# EAGLE design 32sog(a) (EAGLE 7.2.0)
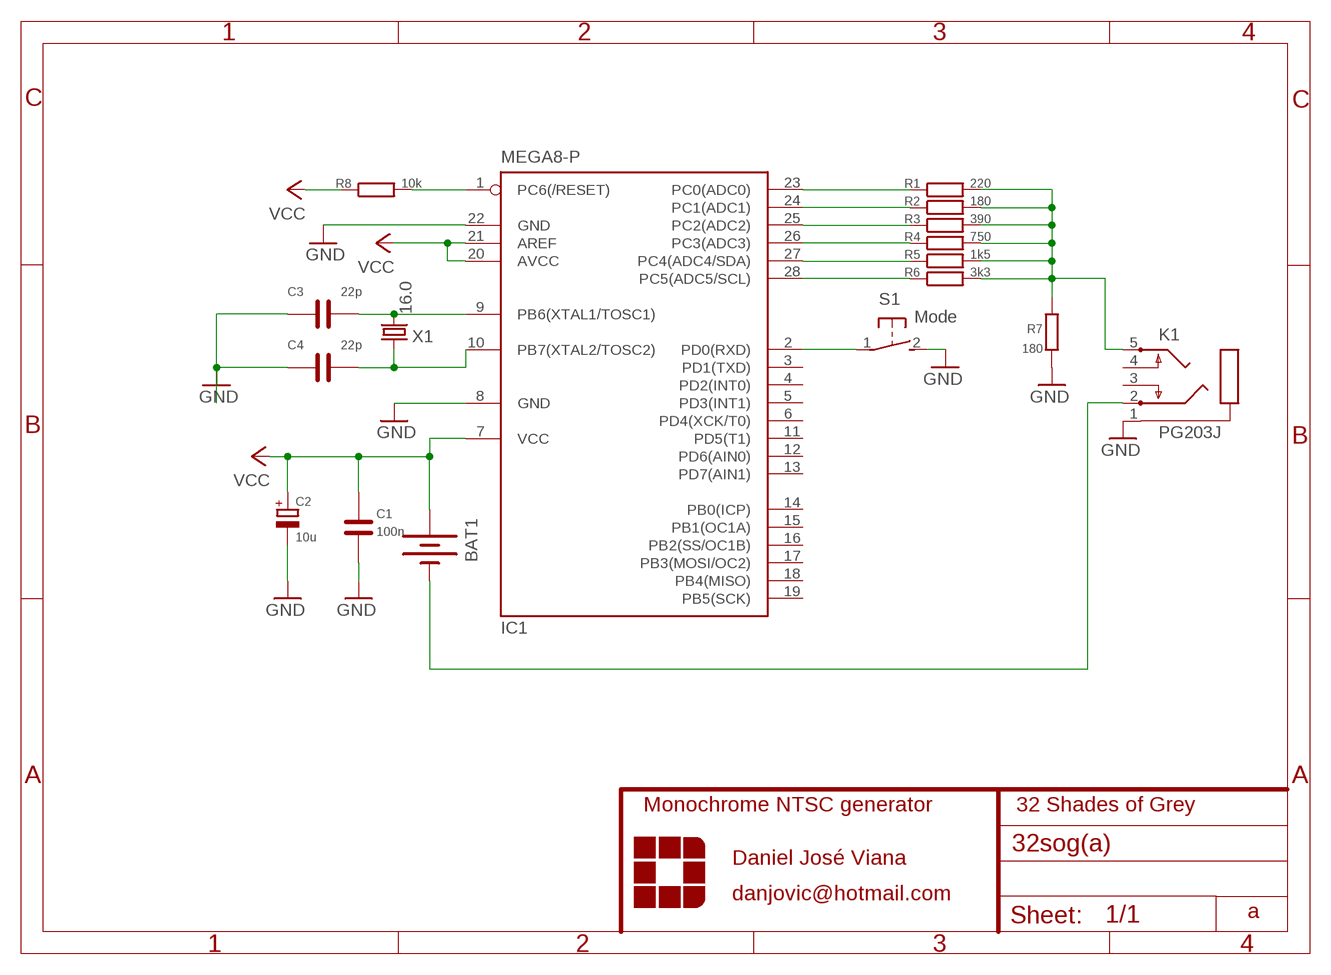
[diagram p0: schematic, sheet 1]

## Parts
BAT1  BATTERY20PTH  [BATTCOM_20MM_PTH]
C1  100n  CCERAMICO  [C050-024X044]
C2  10u  CPOL-EUE2-4_LARGEPADS  [E2-4_LARGEPADS]
C3  22p  CCERAMICO  [C050-024X044]
C4  22p  CCERAMICO  [C050-024X044]
IC1  MEGA8-P  [DIL28-3]
K1  PG203J  [PG203J]
R1  220  R-EU_0207/7  [0207/7]
R2  180  R-EU_0207/7  [0207/7]
R3  390  R-EU_0207/7  [0207/7]
R4  750  R-EU_0207/7  [0207/7]
R5  1k5  R-EU_0207/7  [0207/7]
R6  3k3  R-EU_0207/7  [0207/7]
R7  180  R-EU_0207/7  [0207/7]
R8  10k  R-EU_0207/7  [0207/7]
S1  Mode  31-XX  [B3F-31XX]
X1  16.0  CRYSTALHC49S  [HC49/S]

## Nets
GND: C1.1 C2.- C3.1 C4.1 IC1.8(GND) IC1.22(GND) K1.1 R7.2 S1.2(S)
N$1: IC1.23(PC0(ADC0)) R1.1
N$2: IC1.25(PC2(ADC2)) R3.1
N$3: IC1.1(PC6(/RESET)) R8.2
N$4: IC1.27(PC4(ADC4/SDA)) R5.1
N$5: IC1.24(PC1(ADC1)) R2.1
N$6: IC1.26(PC3(ADC3)) R4.1
N$7: IC1.28(PC5(ADC5/SCL)) R6.1
N$8: C3.2 IC1.9(PB6(XTAL1/TOSC1)) X1.2
N$9: BAT1.2(-) K1.2
N$10: K1.5 R1.2 R2.2 R3.2 R4.2 R5.2 R6.2 R7.1
N$11: C4.2 IC1.10(PB7(XTAL2/TOSC2)) X1.1
N$12: IC1.2(PD0(RXD)) S1.1(P)
VCC: BAT1.1(+) C1.2 C2.+ IC1.7(VCC) IC1.20(AVCC) IC1.21(AREF) R8.1
Unconnected: IC1.3(PD1(TXD)) IC1.4(PD2(INT0)) IC1.5(PD3(INT1)) IC1.6(PD4(XCK/T0)) IC1.11(PD5(T1)) IC1.12(PD6(AIN0)) IC1.13(PD7(AIN1)) IC1.14(PB0(ICP)) IC1.15(PB1(OC1A)) IC1.16(PB2(SS/OC1B)) IC1.17(PB3(MOSI/OC2)) IC1.18(PB4(MISO)) IC1.19(PB5(SCK)) K1.3 K1.4

## Notes on the sheet
- Monochrome NTSC generator | 32 Shades of Grey
- Daniel José Viana
- danjovic@hotmail.com
- a

## Library data of the parts
BAT1 = SparkFun-Electromechanical:BATTERY: Battery Holders Various common sizes : AA, AAA, 18650 (PRT-12895), 20mm coin cell and 12mm coin cell. 20MM_4LEGS, BATT-10373
C1 C3 C4 = diversos2:C*
C2 = rcl:CPOL-EU: POLARIZED CAPACITOR, European symbol
IC1 = atmel:MEGA8-P: MICROCONTROLLER 8 Kbytes FLASH, 1 kbytes SRAM, 512 bytes EEPROM, USART, 4-channel 10 bit ADC, 2-channel 8 bit ADC Pin compatible with Atmega48, ATMega88, ATMega168 Source: avr.lbr; OC_FARNELL: unknown; OC_NEWARK: unknown
K1 = con-hirschmann:PG203J: MIC/HEADPHONE JACK KS-S stereo microphone/headphone jack PG203JN (Schukat); OC_FARNELL: unknown; OC_NEWARK: unknown
R1-R8 = rcl:R-EU_: RESISTOR, European symbol
S1 = switch-omron:31-XX: OMRON SWITCH; MPN: B3F-3100; OC_FARNELL: 959704; OC_NEWARK: 36M3582
X1 = crystal:CRYSTAL: CRYSTAL; OC_FARNELL: 1667008; OC_NEWARK: unknown

## Board
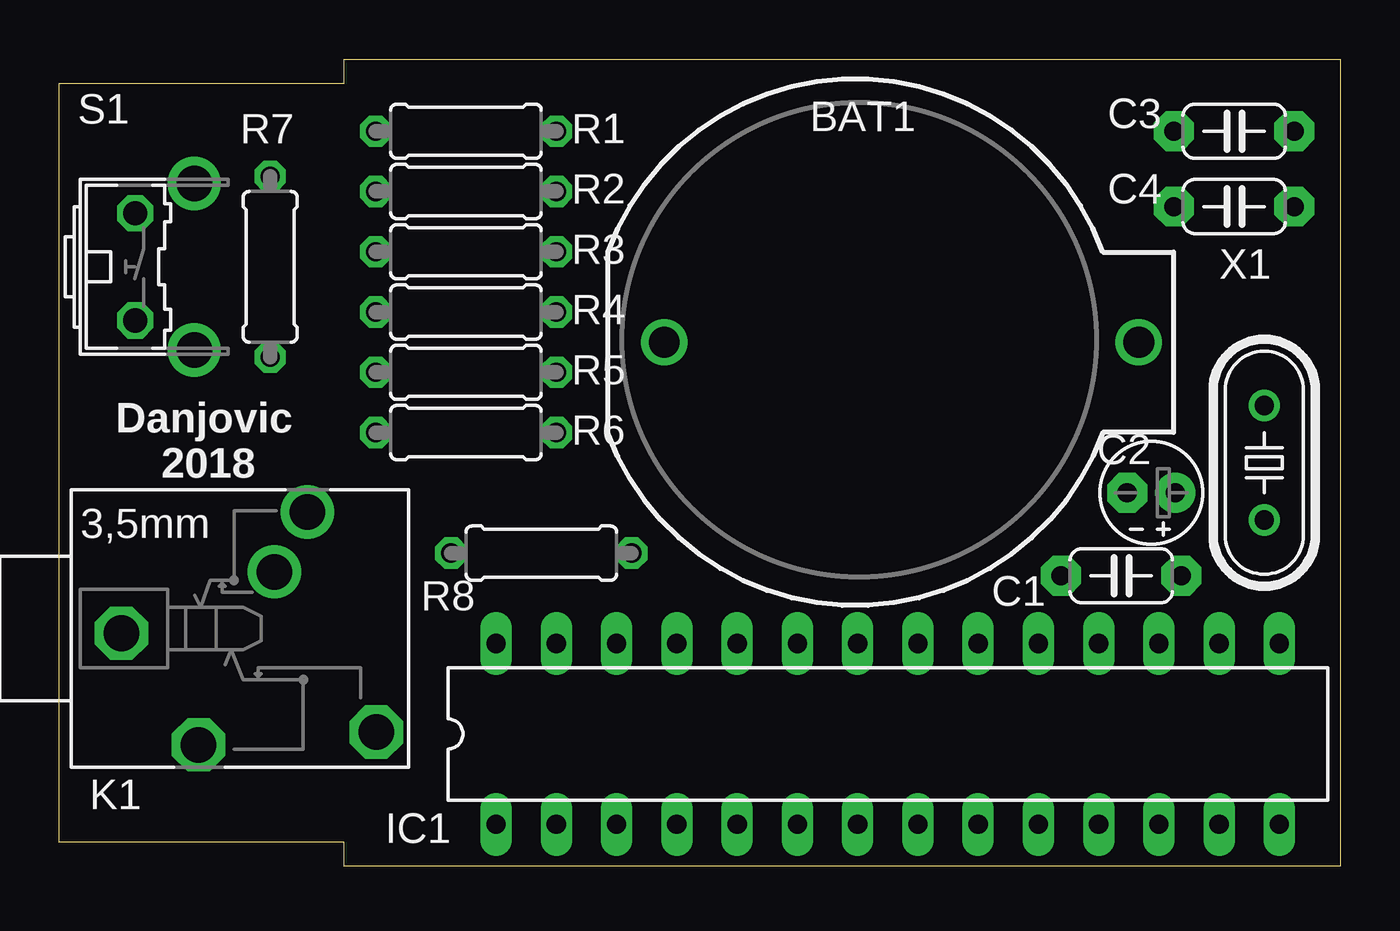
[diagram p1: board, top side]
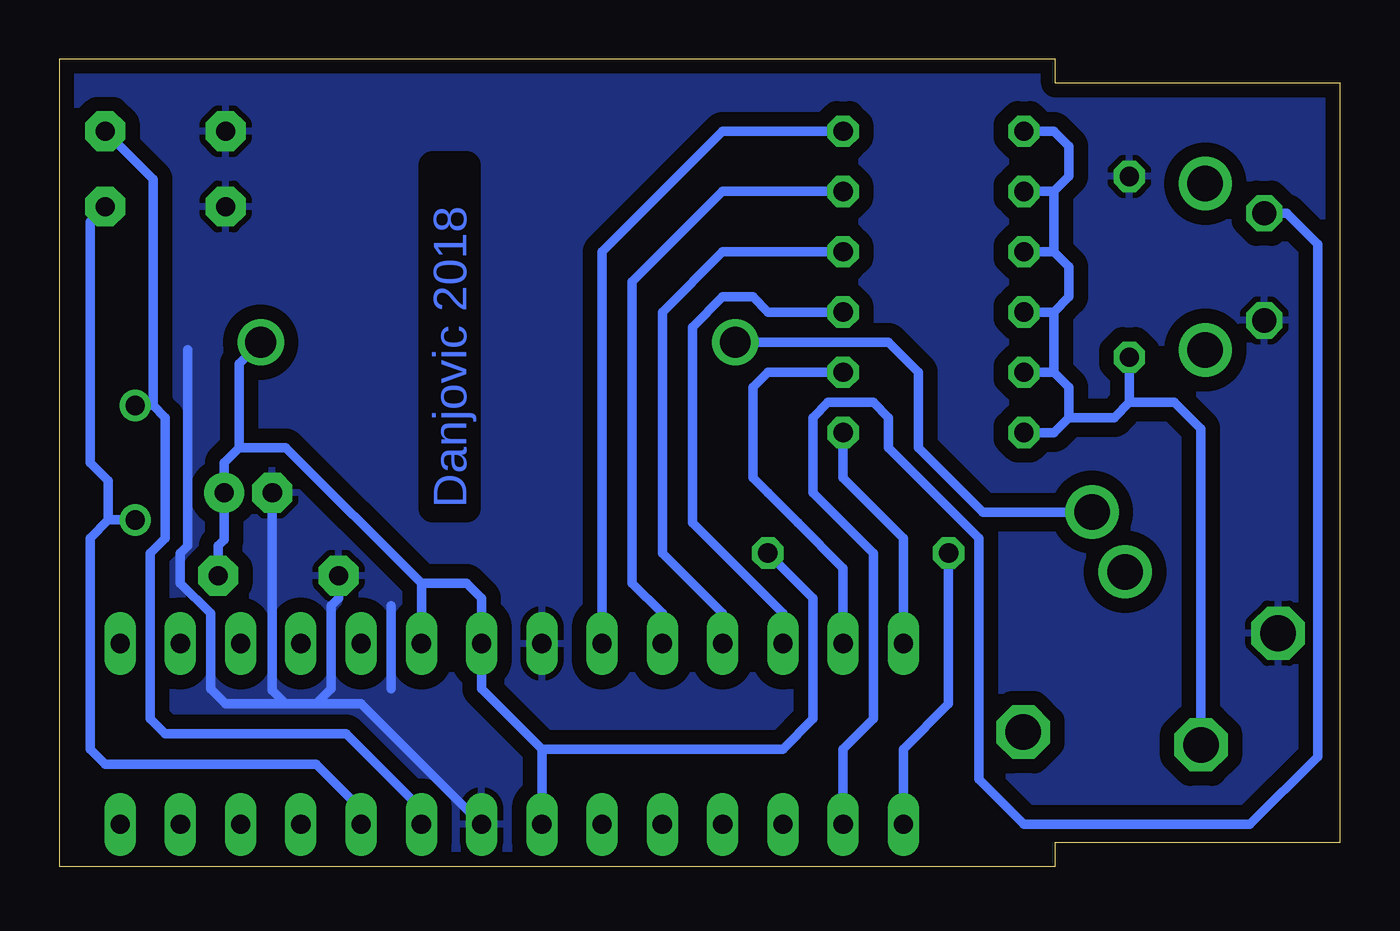
[diagram p2: board, bottom side, seen from below]

Size 54 x 34 mm. Coordinates in mm from the lower left corner, seen from the top.
Copper layers (1*16): Top 0.035mm / dielectric 1.5mm / Bottom 0.035mm
Design rules "default *": minimum track width 10mil, minimum drill 24mil, track to track 8mil, track to pad 8mil, pad to pad 8mil, via to via 8mil, smd to smd 8mil, copper to edge 20mil, drill to drill 8mil, minimum pad ring 10mil, minimum via ring 8mil, stop-mask expansion 4mil, vias tented up to drill 0mil, thermal gap 10mil

### Footprints (pad centres in the part's own frame; a part is rotated, then mirrored left to right if it is on the bottom)
BATTCOM_20MM_PTH = drill 1.3: 1 11.85,0; 2 -8.15,0
C050-024X044 = drill 0.8 pad 1.676 octagon: 1 -2.54,0; 2 2.54,0
E2-4_LARGEPADS = drill 0.813 pad 1.676: + -1.016,0 | drill 0.813 pad 1.676 octagon: - 1.016,0
DIL28-3 = drill 0.813 long: 1 -16.51,-3.81; 2 -13.97,-3.81; 3 -11.43,-3.81; 4 -8.89,-3.81; 5 -6.35,-3.81; 6 -3.81,-3.81; 7 -1.27,-3.81; 8 1.27,-3.81; 9 3.81,-3.81; 10 6.35,-3.81; 11 8.89,-3.81; 12 11.43,-3.81; 13 13.97,-3.81; 14 16.51,-3.81; 15 16.51,3.81; 16 13.97,3.81; 17 11.43,3.81; 18 8.89,3.81; 19 6.35,3.81; 20 3.81,3.81; 21 1.27,3.81; 22 -1.27,3.81; 23 -3.81,3.81; 24 -6.35,3.81; 25 -8.89,3.81; 26 -11.43,3.81; 27 -13.97,3.81; 28 -16.51,3.81
PG203J = drill 1.499 octagon: 1 -5.004,-0.203; 4 5.74,-4.369; 5 -1.753,-4.902 | drill 1.499: 2 2.845,4.902; 3 1.448,2.388
0207/7 = drill 0.813 octagon: 1 -3.81,0; 2 3.81,0
B3F-31XX = drill 1.016 octagon: 1 -2.261,-1.245; 2 2.261,-1.245 | drill 1.499 pad 2.159: 3 -3.505,1.245; 4 3.505,1.245
HC49/S = drill 0.813: 1 -2.413,0; 2 2.413,0

### Placement (x,y rotation side)
BAT1  33.66,22.08 0 top
C1  44.77,12.24 0 top
C2  46.04,15.73 180 top
C3  49.53,30.97 0 top
C4  49.53,27.79 0 top
IC1  34.93,5.57 0 top
K1  7.62,10.02 0 top
R1  17.14,30.97 180 top
R2  17.14,28.43 180 top
R3  17.14,25.89 180 top
R4  17.14,23.35 180 top
R5  17.14,20.81 180 top
R6  17.14,18.27 180 top
R7  8.89,25.25 90 top
R8  20.32,13.19 180 top
S1  4.45,25.25 270 top
U$1  [TIC_TAC_INSET]  0,17 0 top
X1  50.8,17 90 top

### Tracks (layer width: path | path; a pad name or v marks a point on that pad's centre or on a via)
GND
  Bottom 0.406: IC1.8 41.27,6.84 46.99,6.84 47.62,7.47 47.62,10.65 48.9,11.92 48.9,13.19 48.58,13.51 48.58,21.76 | C2.- 45.02,7.41 44.45,6.84 43.18,6.84 42.55,7.47 42.55,10.97 42.23,11.28 C1.1 | 40.01,7.47 40.01,10.97
  pour Bottom (isolate 0.61): -0.64,34.14 -0.64,-0.15 54.61,-0.15 54.61,34.14
N$1
  Bottom 0.406: IC1.23 31.11,25.89 26.04,30.97 R1.1
N$2
  Bottom 0.406: IC1.25 26.04,10.65 28.57,13.19 28.57,23.35 26.04,25.89 R3.1
N$3
  Bottom 0.406: R8.2 16.51,6.84 18.41,4.93 IC1.1
N$4
  Bottom 0.406: IC1.27 20.95,12.55 22.86,14.46 24.13,15.73 24.76,16.36 24.76,20.17 24.13,20.81 R5.1
N$5
  Bottom 0.406: IC1.24 28.57,10.65 29.84,11.92 29.84,24.62 26.04,28.43 R2.1
N$6
  Bottom 0.406: R4.1 24.13,23.35 24.76,23.98 26.04,23.98 27.3,22.71 27.3,14.46 23.49,10.65 IC1.26
N$7
  Bottom 0.406: IC1.28 18.41,13.82 20.95,16.36 R6.1
N$8
  Bottom 0.406: IC1.9 38.73,2.39 41.91,5.57 49.53,5.57 50.16,6.2 50.16,13.19 49.53,13.82 49.53,18.9 50.04,19.41 | X1.2 50.04,19.41 | 50.04,19.41 50.04,28.94 C3.2
N$9
  Bottom 0.406: K1.2 15.06,14.92 17.78,17.63 17.78,20.81 19.05,22.08 BAT1.2
N$10
  Bottom 0.406: K1.5 5.87,18.42 6.99,19.54 8.89,19.54 | 8.89,19.54 9.53,18.9 11.43,18.9 | 11.43,18.9 12.06,18.27 R6.2 | R7.1 8.89,19.54 | R5.2 12.06,20.81 | 12.06,20.81 11.43,20.17 11.43,18.9 | R4.2 12.06,23.35 | 12.06,23.35 12.06,20.81 | R3.2 12.06,25.89 | 12.06,25.89 11.43,25.25 11.43,23.98 12.06,23.35 | R2.2 12.06,28.43 | 12.06,28.43 12.06,25.89 | R1.2 12.06,30.97 11.43,30.34 11.43,29.06 12.06,28.43
N$11
  Bottom 0.406: IC1.10 41.27,2.39 43.18,4.3 52.07,4.3 52.71,4.93 52.71,13.82 51.94,14.59 | X1.1 51.94,14.59 | 51.94,14.59 51.94,16.24 52.71,17 52.71,27.16 C4.2
N$12
  Bottom 0.406: S1.1 2.26,27.52 0.95,26.21 0.95,4.62 3.81,1.76 13.34,1.76 15.24,3.66 15.24,13.82 19.05,17.63 19.05,18.9 19.68,19.54 21.59,19.54 22.22,18.9 22.22,15.73 19.68,13.19 19.68,6.2 20.95,4.93 IC1.2
VCC
  Bottom 0.406: IC1.7 33.66,4.93 | 33.66,4.93 36.2,7.47 IC1.21 36.2,11.28 36.83,11.92 38.73,11.92 | 38.73,11.92 IC1.20 | C1.2 47.31,13.51 47.05,13.76 C2.+ 47.05,17 46.42,17.63 | 38.73,11.92 44.45,17.63 46.42,17.63 | 46.42,17.63 46.42,21.17 BAT1.1 | R8.1 22.22,11.28 22.22,6.2 23.49,4.93 33.66,4.93

### Text on the board
Bottom: Danjovic 2018
tPlace: Danjovic | 2018